# EAGLE schematic tkexample-biasing (EAGLE 7.5.0)
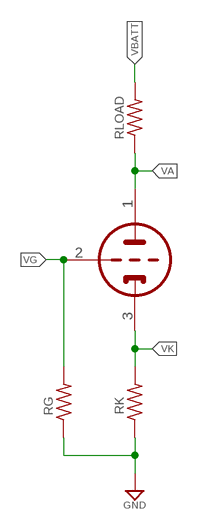
[diagram p0: schematic, sheet 1]

## Parts
RG  R-US_R1206  [R1206]
RK  R-US_R1206  [R1206]
RLOAD  R-US_R1206  [R1206]
V1  12AX7-P  [NOVAL]

## Nets
GND: RG.1 RK.1
VA: RLOAD.1 V1.1(A:TA)
VBATT: RLOAD.2
VG: RG.2 V1.2(A:TG)
VK: RK.2 V1.3(A:TK)
Unconnected: V1.4(":H1) V1.5(":H3) V1.6(B:TA) V1.7(B:TG) V1.8(B:TK) V1.9(":H2)

## Library data of the parts
RG RK RLOAD = holla:R
V1 = tubes:12AX7-P